# Altium schematic sheet EFR32BG13_Slave.SchDoc: EFR32BG13 Blue Gecko Slave
size A4; Author: Sarthak Jain; DrawnBy: Sarthak Jain; Engineer: Sarthak Jain; Organization: University of Colorado; Address1: Boulder; Address2: Bhishma; Address3: Low Power Embedded; Address4: Design Techniques; Revision: 0.1; SheetNumber: 8; SheetTotal: 9; ProjectName: Bhishma
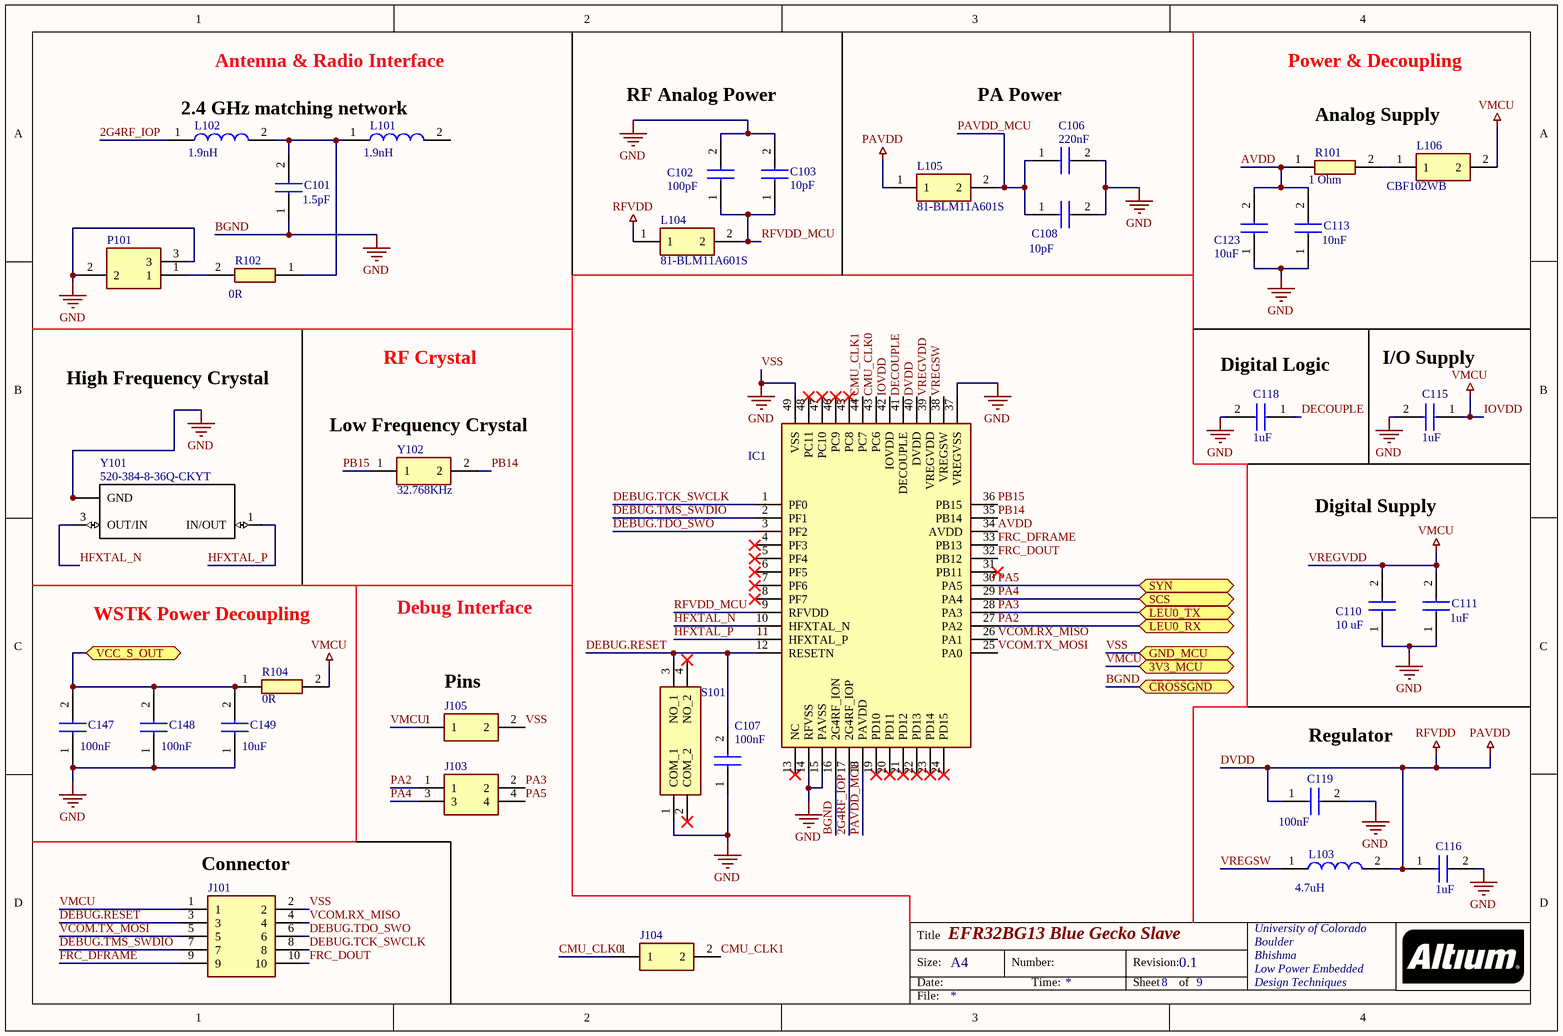
[diagram p0: EFR32BG13_Slave.SchDoc]

## Parts
C101  value 1.5pF  [CAPC1608X90N]
C102  value 100pF  [CAPC1608X90N]  (hidden comment: 81-GCG1885G1H101JA1D)
C103  value 10pF  [CAPC1608X90N]  (hidden comment: 81-GCG1885G1H100JA1D)
C106  value 220nF  [CAPC1608X90N]  (hidden comment: 81-GCM188R71E224K55D)
C107  value 100nF  [CAPC1608X90N]  (hidden comment: 581-0603YC104JAT4A)
C108  value 10pF  [CAPC1608X90N]  (hidden comment: 81-GCG1885G1H100JA1D)
C110  value 10 uF  [CAPC1608X90N]  (hidden comment: 81-GRM188R61E106KA3D)
C111  value 1uF  [CAPC1608X90N]  (hidden comment: 81-GCM188R71C105K64D)
C113  value 10nF  [CAPC1608X90N]  (hidden comment: 81-GCM1887U1H103JA6J)
C115  value 1uF  [CAPC1608X90N]  (hidden comment: 81-GCM188R71C105K64D)
C116  value 1uF  [CAPC1608X90N]  (hidden comment: 81-GCM188R71C105K64D)
C118  value 1uF  [CAPC1608X90N]  (hidden comment: 81-GCM188R71C105K64D)
C119  value 100nF  [CAPC1608X90N]  (hidden comment: 581-0603YC104JAT4A)
C123  value 10uF  [CAPC1608X90N]  (hidden comment: 81-GRM188R61E106KA3D)
C147  value 100nF  [CAPC1608X90N]  (hidden comment: 581-0603YC104JAT4A)
C148  value 100nF  [CAPC1608X90N]  (hidden comment: 581-0603YC104JAT4A)
C149  value 10uF  [CAPC1608X90N]  (hidden comment: 81-GRM188R61E106KA3D)
IC1  634-BGP632F512GM48D  [QFN50P700X700X90-49N-D]  (value not drawn)
J101  200-FTSH10501FDVK  [SAMTEC_FTSH-105-01-L-DV]  (value not drawn)
J103  538-87898-0424  [878980424]  (value not drawn)
J104  538-87898-0204  [878980204]  (value not drawn)
J105  538-87898-0204  [878980204]  (value not drawn)
L101  value 1.9nH  [LQP03TQ0N6B02D]
L102  value 1.9nH  [LQP03TQ0N6B02D]
L103  value 4.7uH  [INDC1608X95N]  (hidden comment: 810-KLZ1608MHR4R7WTD)
L104  81-BLM11A601S  [BEADC1608X95N]
L105  81-BLM11A601S  [BEADC1608X95N]
L106  value CBF102WB  [BEADC1608X100N]  (hidden comment: 710-74279266)
P101  798-U.FL-R-SMT-110  [U.FL-R-SMT-1(10)]  (value not drawn)
R101  value 1 Ohm  [RESC1608X55N]  (hidden comment: 279-CRGS0603J1R0)
R102  value 0R  [RESC3216X60N]  (hidden comment: 71-CRCW12060000Z0EAC)
R104  value 0R  [RESC3216X60N]  (hidden comment: 71-CRCW12060000Z0EAC)
S101  612-LL3301AF065QJ  [LL3301FF065QJ]  (value not drawn)
Y101  520-384-8-36Q-CKYT  [*XTAL_ECS-384-8-36Q-CKY-TR]
Y102  value 32.768KHz  [CM8V32768TA020125]  (hidden comment: 428-201410-MC01)

## Ports
3V3_MCU, CROSSGND, GND_MCU, LEU0_RX, LEU0_TX, SCS, SYN, VCC_S_OUT

## Nets
BGND: C101.1 C102.2 C103.2 C106.2 C107.1 C108.2 C110.1 C111.1 C113.1 C115.2 C116.2 C118.2 C119.2 C123.1 C147.1 C148.1 C149.1 IC1.14(RFVSS) IC1.15(PAVSS) IC1.16(2G4RF_ION) IC1.37(VREGVSS) IC1.49(VSS) J101.2 J105.2 P101.2 P101.3 S101.1(COM_1) Y101.2(GND) Y101.4(GND) ; port GND_MCU, port CROSSGND  [also labelled GND, VSS]
DVDD: C116.1 C119.1 IC1.40(DVDD) L103.2 L104.1 L105.1  [also labelled PAVDD, RFVDD]
IOVDD: C110.2 C111.2 C115.1 IC1.39(VREGVDD) IC1.42(IOVDD) J101.1 J105.1 L106.2 R104.2 ; port 3V3_MCU  [also labelled VMCU, VREGVDD]
2G4RF_IOP: IC1.17(2G4RF_IOP) L102.1
AVDD: C113.2 C123.2 IC1.34(AVDD) R101.1
CMU_CLK0: IC1.43(PC6) J104.1
CMU_CLK1: IC1.44(PC7) J104.2
DEBUG.RESET: C107.2 IC1.12(RESETN) J101.3 S101.3(NO_1)
DEBUG.TCK_SWCLK: IC1.1(PF0) J101.8
DEBUG.TDO_SWO: IC1.3(PF2) J101.6
DEBUG.TMS_SWDIO: IC1.2(PF1) J101.7
DECOUPLE: C118.1 IC1.41(DECOUPLE)
FRC_DFRAME: IC1.33(PB13) J101.9
FRC_DOUT: IC1.32(PB12) J101.10
HFXTAL_N: IC1.10(HFXTAL_N) Y101.3(OUT/IN)
HFXTAL_P: IC1.11(HFXTAL_P) Y101.1(IN/OUT)
PA2: IC1.27(PA2) J103.1 ; port LEU0_RX
PA3: IC1.28(PA3) J103.2 ; port LEU0_TX
PA4: IC1.29(PA4) J103.3 ; port SCS
PA5: IC1.30(PA5) J103.4 ; port SYN
PAVDD_MCU: C106.1 C108.1 IC1.18(PAVDD) L105.2
PB14: IC1.35(PB14) Y102.2
PB15: IC1.36(PB15) Y102.1
RFVDD_MCU: C102.1 C103.1 IC1.9(RFVDD) L104.2
VCC_S_OUT: C147.2 C148.2 C149.2 R104.1 ; port VCC_S_OUT
VCOM.RX_MISO: IC1.26(PA1) J101.4
VCOM.TX_MOSI: IC1.25(PA0) J101.5
VREGSW: IC1.38(VREGSW) L103.1
NetC101_2: C101.2 L101.1 L102.2 R102.1
NetL106_1: L106.1 R101.2
NetP101_1: P101.1 R102.2

Not connected (* = marked no-connect by the designer): IC1 4(PF3)* 5(PF4)* 6(PF5)* 7(PF6)* 8(PF7)* 13(NC)* 19(PD10)* 20(PD11)* 21(PD12)* 22(PD13)* 23(PD14)* 24(PD15)* 31(PB11)* 45(PC8)* 46(PC9)* 47(PC10)* 48(PC11)*; L101 2; S101 2(COM_2)* 4(NO_2)*

## Notes on the sheet
- 2.4 GHz matching network
- Antenna & Radio Interface
- RF Analog Power
- PA Power
- Power & Decoupling
- Analog Supply
- High Frequency Crystal
- RF Crystal
- (near C118) Digital Logic
- (near C115) I/O Supply
- (near Y102) Low Frequency Crystal
- Digital Supply
- WSTK Power Decoupling
- Debug Interface
- (near J105) Pins
- Regulator
- (near J101) Connector
- Title
- Size:
- Date:
- A4
- Number:
- Time:
- Revision:
- Sheet
- of
- File:

## Library data of the parts
C101 = GRM1885C1H1R5CA01D: Capacitor; Manufacturer_Name: Murata Electronics; Datasheet Link: http://www.murata.com/~/media/webrenewal/support/library/catalog/products/capacitor/mlcc/c02e.pdf; Height: 0.9mm; Manufacturer_Part_Number: GRM1885C1H1R5CA01D; RS Part Number: 7769236; RS Price/Stock: https://uk.rs-online.com/web/p/products/7769236
C102 = GCG1885G1H101JA01D: Capacitor; Manufacturer_Name: Murata Electronics; Datasheet Link: https://psearch.en.murata.com/capacitor/product/GCG1885G1H101JA01%23.html; Height: 0.9mm; Manufacturer_Part_Number: GCG1885G1H101JA01D; Mouser Part Number: 81-GCG1885G1H101JA1D; Mouser Price/Stock: https://www.mouser.com/Search/Refine.aspx?Keyword=81-GCG1885G1H101JA1D
C103 C108 = GCG1885G1H100JA01D: Capacitor; Manufacturer_Name: Murata Electronics; Datasheet Link: https://psearch.en.murata.com/capacitor/product/GCG1885G1H100JA01%23.html; Height: 0.9mm; Manufacturer_Part_Number: GCG1885G1H100JA01D; Mouser Part Number: 81-GCG1885G1H100JA1D; Mouser Price/Stock: https://www.mouser.com/Search/Refine.aspx?Keyword=81-GCG1885G1H100JA1D
C106 = GCM188R71E224KA55D: Capacitor; Manufacturer_Name: Murata Electronics; Datasheet Link: https://psearch.en.murata.com/capacitor/product/GCM188R71E224KA55%23.html; Height: 0.9mm; Manufacturer_Part_Number: GCM188R71E224KA55D; Mouser Part Number: 81-GCM188R71E224K55D; Mouser Price/Stock: https://www.mouser.com/Search/Refine.aspx?Keyword=81-GCM188R71E224K55D; RS Part Number: 7234976P; RS Price/Stock: http://uk.rs-online.com/web/p/products/7234976P
C107 C119 C147 C148 = 0603YC104JAT4A: Capacitor; Manufacturer_Name: AVX; Datasheet Link: https://componentsearchengine.com/Datasheets/1/06031A100FAT2A.pdf; Height: 0.9mm; Manufacturer_Part_Number: 0603YC104JAT4A; Mouser Part Number: 581-0603YC104JAT4A; Mouser Price/Stock: https://www.mouser.com/Search/Refine.aspx?Keyword=581-0603YC104JAT4A
C110 C123 C149 = GRM188R61E106KA73D: Capacitor; Manufacturer_Name: Murata Electronics; Datasheet Link: http://componentsearchengine.com/Datasheets/1/GRM188R61E106KA73D.pdf; Height: 0.9mm; Manufacturer_Part_Number: GRM188R61E106KA73D; Mouser Part Number: 81-GRM188R61E106KA3D; Mouser Price/Stock: https://www.mouser.com/Search/Refine.aspx?Keyword=81-GRM188R61E106KA3D
C111 C115 C116 C118 = GCM188R71C105KA64D: Capacitor; Manufacturer_Name: Murata Electronics; Datasheet Link: https://psearch.en.murata.com/capacitor/product/GCM188R71C105KA64%23.html; Height: 0.9mm; Manufacturer_Part_Number: GCM188R71C105KA64D; Mouser Part Number: 81-GCM188R71C105K64D; Mouser Price/Stock: https://www.mouser.com/Search/Refine.aspx?Keyword=81-GCM188R71C105K64D; RS Part Number: 7900562P; RS Price/Stock: http://uk.rs-online.com/web/p/products/7900562P
C113 = GCM1887U1H103JA16J: Capacitor; Manufacturer_Name: Murata Electronics; Datasheet Link: https://psearch.en.murata.com/capacitor/product/GCM1887U1H103JA16%23.html; Height: 0.9mm; Manufacturer_Part_Number: GCM1887U1H103JA16J; Mouser Part Number: 81-GCM1887U1H103JA6J; Mouser Price/Stock: https://www.mouser.com/Search/Refine.aspx?Keyword=81-GCM1887U1H103JA6J
IC1 = EFR32BG13P632F512GM48-D: Integrated Circuit; Manufacturer_Name: Silicon Labs; Datasheet Link: https://componentsearchengine.com/Datasheets/1/EFR32BG13P632F512GM48-D.pdf; Height: 0.9mm; Manufacturer_Part_Number: EFR32BG13P632F512GM48-D; Mouser Part Number: 634-BGP632F512GM48D; Mouser Price/Stock: https://www.mouser.com/Search/Refine.aspx?Keyword=634-BGP632F512GM48D
J101 = FTSH-105-01-F-DV-K: Connector; Manufacturer_Name: SAMTEC; Datasheet Link: http://suddendocs.samtec.com/prints/ftsh-1xx-xx-xxx-dv-xxx-xxx-mkt.pdf; Manufacturer_Part_Number: FTSH-105-01-F-DV-K; Mouser Part Number: 200-FTSH10501FDVK; Mouser Price/Stock: https://www.mouser.com/Search/Refine.aspx?Keyword=200-FTSH10501FDVK; RS Part Number: 1592372; RS Price/Stock: http://uk.rs-online.com/web/p/products/1592372
J103 = 87898-0424: Connector; Manufacturer_Name: Molex; Allied_Number: 71465829; Datasheet Link: https://componentsearchengine.com/Datasheets/1/87898-0424.pdf; Height: 9.65mm; Manufacturer_Part_Number: 87898-0424; Mouser Part Number: 538-87898-0424; Mouser Price/Stock: https://www.mouser.com/Search/Refine.aspx?Keyword=538-87898-0424; Allied Price/Stock: https://www.alliedelec.com/molexincorporated-87898-0424/71465829/
J104 J105 = 87898-0204: Connector; Manufacturer_Name: Molex; Allied_Number: 70967354; Datasheet Link: https://www.molex.com/pdm_docs/sd/878980204_sd.pdf; Height: 8.33mm; Manufacturer_Part_Number: 87898-0204; Mouser Part Number: 538-87898-0204; Mouser Price/Stock: https://www.mouser.com/Search/Refine.aspx?Keyword=538-87898-0204; Allied Price/Stock: https://www.alliedelec.com/molex-incorporated-87898-0204/70967354/
L101 L102 = LQP03TQ1N9C02D: Inductor; Manufacturer_Name: Murata Electronics; Datasheet Link: https://psearch.en.murata.com/inductor/product/LQP03TQ1N9C02%23.html; Height: 0.6mm; Manufacturer_Part_Number: LQP03TQ1N9C02D
L103 = KLZ1608MHR4R7WTD25: Inductor; Manufacturer_Name: TDK; Datasheet Link: http://www.mouser.com/datasheet/2/400/nductor_automotive_decoupling_klz1608-hr_en-1108665.pdf; Height: 0.95mm; Manufacturer_Part_Number: KLZ1608MHR4R7WTD25; Mouser Part Number: 810-KLZ1608MHR4R7WTD; Mouser Price/Stock: https://www.mouser.com/Search/Refine.aspx?Keyword=810-KLZ1608MHR4R7WTD
L104 L105 = BLM18AG601SN1D: Filter; Manufacturer_Name: Murata Electronics; Datasheet Link: https://www.murata.com/en-us/products/productdetail?partno=BLM18AG601SN1%23; Height: 0.95mm; Manufacturer_Part_Number: BLM18AG601SN1D; Mouser Part Number: 81-BLM11A601S; Mouser Price/Stock: https://www.mouser.com/Search/Refine.aspx?Keyword=81-BLM11A601S; RS Part Number: 0110380; RS Price/Stock: http://uk.rs-online.com/web/p/products/0110380
L106 = 74279266: Ferrite Bead; Manufacturer_Name: Wurth Elektronik; Datasheet Link: http://uk.rs-online.com/web/p/products/3674856; Height: 1mm; Manufacturer_Part_Number: 74279266; Mouser Part Number: 710-74279266; Mouser Price/Stock: https://www.mouser.com/Search/Refine.aspx?Keyword=710-74279266; RS Part Number: 1241858P; RS Price/Stock: http://uk.rs-online.com/web/p/products/1241858P
P101 = U.FL-R-SMT-1(10): Connector; Manufacturer_Name: Hirose; Datasheet Link: https://www.hirose.com/product/en/download_file/key_name/U.FL-R-SMT-1%2810%29/category/Drawing%20(2D)/doc_file_id/37627/?file_category_id=6&item_id=03310472210&is_series=; Manufacturer_Part_Number: U.FL-R-SMT-1(10); Mouser Part Number: 798-U.FL-R-SMT-110; Mouser Price/Stock: https://www.mouser.com/Search/Refine.aspx?Keyword=798-U.FL-R-SMT-110; RS Part Number: 0557981; RS Price/Stock: http://uk.rs-online.com/web/p/products/0557981
R101 = CRGS0603J1R0: Resistor; Manufacturer_Name: TE Connectivity; Datasheet Link: http://www.te.com/commerce/DocumentDelivery/DDEController?Action=showdoc&DocId=Data+Sheet%7F9-1773463-8%7FB%7Fpdf%7FEnglish%7FENG_DS_9-1773463-8_B.pdf%7F3-2176243-7; Height: 0.55mm; Manufacturer_Part_Number: CRGS0603J1R0; Mouser Part Number: 279-CRGS0603J1R0; Mouser Price/Stock: https://www.mouser.com/Search/Refine.aspx?Keyword=279-CRGS0603J1R0; RS Part Number: 9044983P; RS Price/Stock: http://uk.rs-online.com/web/p/products/9044983P
R102 R104 = CRCW12060000Z0EAC: Resistor; Manufacturer_Name: Vishay; Datasheet Link: http://componentsearchengine.com/Datasheets/1/CRCW12060000Z0EAC.pdf; Height: 0.6mm; Manufacturer_Part_Number: CRCW12060000Z0EAC; Mouser Part Number: 71-CRCW12060000Z0EAC; Mouser Price/Stock: https://www.mouser.com/Search/Refine.aspx?Keyword=71-CRCW12060000Z0EAC
S101 = LL3301AF065QJ: Switch; Manufacturer_Name: E-Switch; Datasheet Link: https://media.digikey.com/pdf/Data%20Sheets/E-Switch%20PDFs/LL3301AF065QJ.pdf; Height: 7.3mm; Manufacturer_Part_Number: LL3301AF065QJ; Mouser Part Number: 612-LL3301AF065QJ; Mouser Price/Stock: https://www.mouser.com/Search/Refine.aspx?Keyword=612-LL3301AF065QJ
Y101 = ECS-384-8-36Q-CKY-TR: Crystal 38.4mhz 8pf Smd; Manufacturer_Name: ECS Inc.; Package: SMD-4 ECS International; Availability: Unavailable; SnapEDA_Link: https://www.snapeda.com/parts/ECS-384-8-36Q-CKY-TR/ECS%20Inc./view-part/?ref=snap; Price: None; Manufacturer_Part_Number: ECS-384-8-36Q-CKY-TR; Value: *; Mouser Part Number: 520-384-8-36Q-CKYT; Mouser Price/Stock: https://www.mouser.com/ProductDetail/ECS/ECS-384-8-36Q-CKY-TR?qs=%2Fha2pyFaduieYLvRCOUxDiycX6RSF1FiuS1QhwWyXzrQsIptGqg3hkPASiWtTF8J
Y102 = CM8V-T1A-32.768kHz-9pF-20PPM-TA-QC: Crystal or Oscillator; Manufacturer_Name: MICRO CRYSTAL; Datasheet Link: https://www.mouser.co.uk/datasheet/2/530/cm8v-t1a-1085761.pdf; Manufacturer_Part_Number: CM8V-T1A-32.768kHz-9pF-20PPM-TA-QC; Mouser Part Number: 428-201410-MC01; Mouser Price/Stock: https://www.mouser.com/Search/Refine.aspx?Keyword=428-201410-MC01